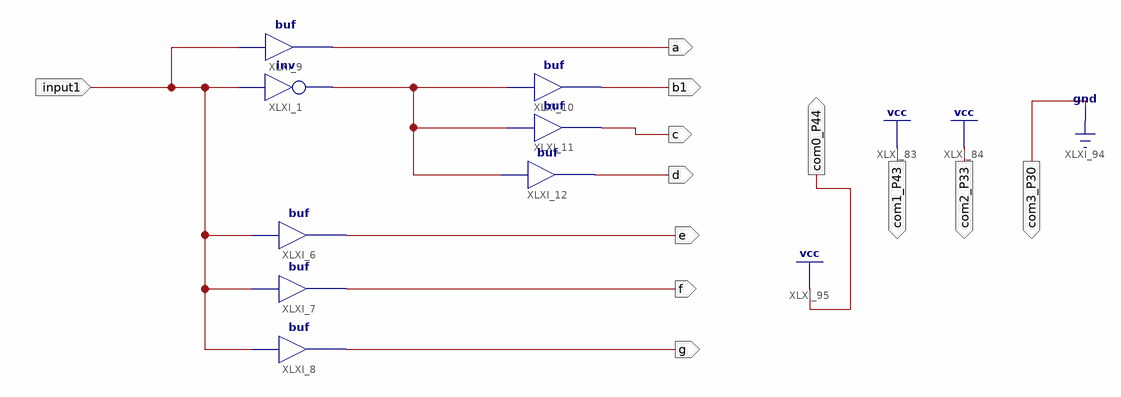
[diagram p0: schematic sheet 1]
// Xilinx ISE schematic displayfull.sch (spartan6) as structural Verilog: 8 symbols, 12 ports
module displayfull (
  input  input1,
  output a,
  output e,
  output f,
  output g,
  output d,
  output c,
  output b1,
  output com1_P43,
  output com2_P33,
  output com3_P30,
  output com0_P44
);

  wire b;

  not XLXI_1 (b, input1);
  buf XLXI_9 (a, input1);
  buf XLXI_6 (e, input1);
  buf XLXI_7 (f, input1);
  buf XLXI_8 (g, input1);
  buf XLXI_10 (b1, b);
  buf XLXI_11 (c, b);
  buf XLXI_12 (d, b);

  assign com0_P44 = 1'b1;
  assign com1_P43 = 1'b1;
  assign com2_P33 = 1'b1;
  assign com3_P30 = 1'b0;
endmodule
